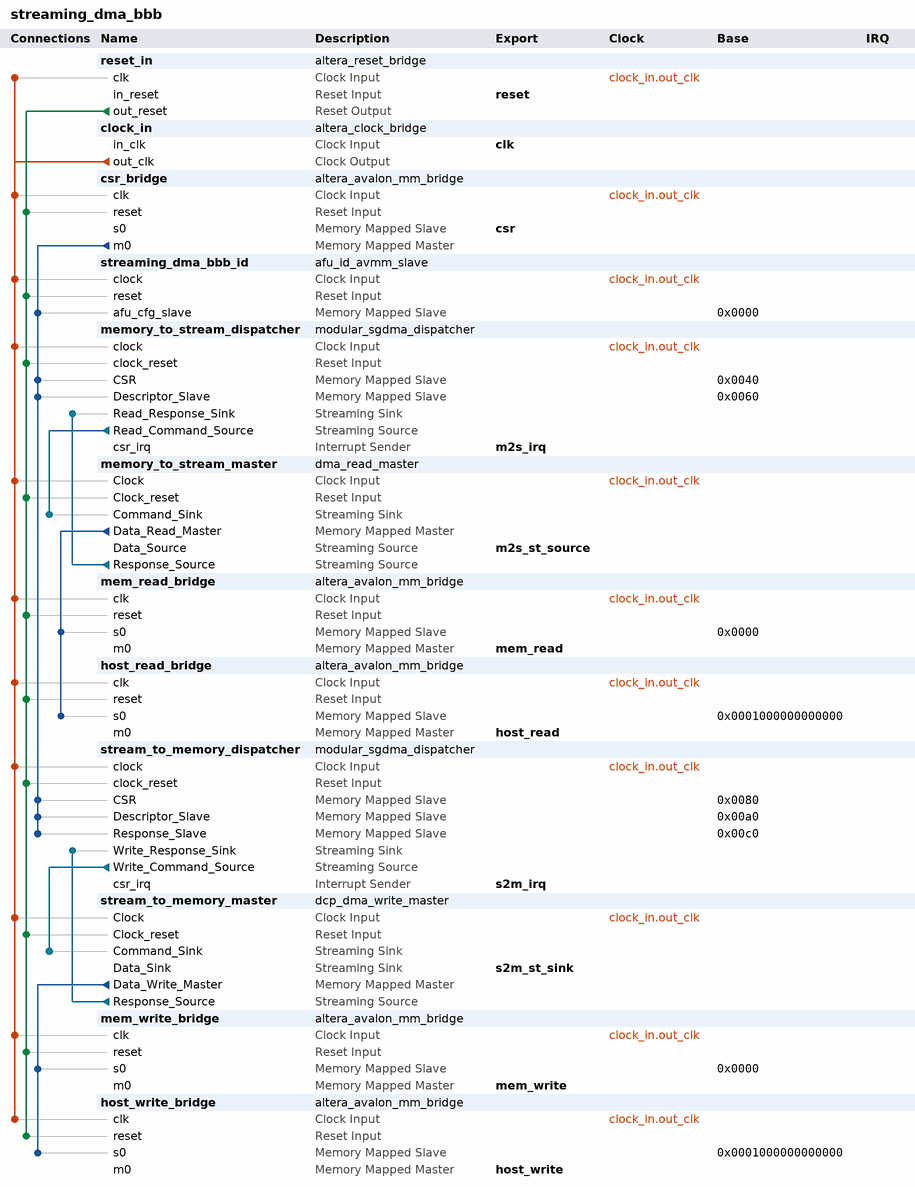
[diagram p0: system contents]
# Platform Designer (Qsys) system streaming_dma_bbb, Arria 10 10AX115N3F40E2SG
# Parameters at their usual value, and those the tool derives, are not listed.
package require -exact qsys 1.0
create_system streaming_dma_bbb
set_project_property DEVICE_FAMILY {Arria 10}
set_project_property DEVICE 10AX115N3F40E2SG

add_component reset_in ip/streaming_dma_bbb/streaming_dma_bbb_reset_in.ip altera_reset_bridge reset_in 17.0

add_component clock_in ip/streaming_dma_bbb/streaming_dma_bbb_clock_in.ip altera_clock_bridge clock_in 17.0

add_component csr_bridge ip/streaming_dma_bbb/csr_bridge.ip altera_avalon_mm_bridge csr_bridge 17.0

add_component streaming_dma_bbb_id ip/streaming_dma_bbb/streaming_dma_bbb_id.ip afu_id_avmm_slave streaming_dma_bbb_id 1.0

add_component memory_to_stream_dispatcher ip/streaming_dma_bbb/memory_to_stream_dispatcher.ip modular_sgdma_dispatcher memory_to_stream_dispatcher 17.0

add_component memory_to_stream_master ip/streaming_dma_bbb/memory_to_stream_master.ip dma_read_master memory_to_stream_master 17.0

add_component mem_read_bridge ip/streaming_dma_bbb/mem_read_bridge.ip altera_avalon_mm_bridge mem_read_bridge 17.0

add_component host_read_bridge ip/streaming_dma_bbb/host_read_bridge.ip altera_avalon_mm_bridge host_read_bridge 17.0

add_component stream_to_memory_dispatcher ip/streaming_dma_bbb/stream_to_memory_dispatcher.ip modular_sgdma_dispatcher stream_to_memory_dispatcher 17.0

add_component stream_to_memory_master ip/streaming_dma_bbb/stream_to_memory_master.ip dcp_dma_write_master stream_to_memory_master 17.0

add_component mem_write_bridge ip/streaming_dma_bbb/mem_write_bridge.ip altera_avalon_mm_bridge mem_write_bridge 17.0

add_component host_write_bridge ip/streaming_dma_bbb/host_write_bridge.ip altera_avalon_mm_bridge host_write_bridge 17.0

# connections
add_connection clock_in.out_clk csr_bridge.clk clock
add_connection clock_in.out_clk host_read_bridge.clk clock
add_connection clock_in.out_clk host_write_bridge.clk clock
add_connection clock_in.out_clk mem_read_bridge.clk clock
add_connection clock_in.out_clk mem_write_bridge.clk clock
add_connection clock_in.out_clk memory_to_stream_dispatcher.clock clock
add_connection clock_in.out_clk memory_to_stream_master.Clock clock
add_connection clock_in.out_clk reset_in.clk clock
add_connection clock_in.out_clk stream_to_memory_dispatcher.clock clock
add_connection clock_in.out_clk stream_to_memory_master.Clock clock
add_connection clock_in.out_clk streaming_dma_bbb_id.clock clock
add_connection reset_in.out_reset csr_bridge.reset reset
add_connection reset_in.out_reset host_read_bridge.reset reset
add_connection reset_in.out_reset host_write_bridge.reset reset
add_connection reset_in.out_reset mem_read_bridge.reset reset
add_connection reset_in.out_reset mem_write_bridge.reset reset
add_connection reset_in.out_reset memory_to_stream_dispatcher.clock_reset reset
add_connection reset_in.out_reset memory_to_stream_master.Clock_reset reset
add_connection reset_in.out_reset stream_to_memory_dispatcher.clock_reset reset
add_connection reset_in.out_reset stream_to_memory_master.Clock_reset reset
add_connection reset_in.out_reset streaming_dma_bbb_id.reset reset
add_connection csr_bridge.m0 memory_to_stream_dispatcher.CSR avalon
set_connection_parameter_value csr_bridge.m0/memory_to_stream_dispatcher.CSR baseAddress 0x0040
add_connection csr_bridge.m0 memory_to_stream_dispatcher.Descriptor_Slave avalon
set_connection_parameter_value csr_bridge.m0/memory_to_stream_dispatcher.Descriptor_Slave baseAddress 0x0060
add_connection csr_bridge.m0 stream_to_memory_dispatcher.CSR avalon
set_connection_parameter_value csr_bridge.m0/stream_to_memory_dispatcher.CSR baseAddress 0x0080
add_connection csr_bridge.m0 stream_to_memory_dispatcher.Descriptor_Slave avalon
set_connection_parameter_value csr_bridge.m0/stream_to_memory_dispatcher.Descriptor_Slave baseAddress 0x00a0
add_connection csr_bridge.m0 stream_to_memory_dispatcher.Response_Slave avalon
set_connection_parameter_value csr_bridge.m0/stream_to_memory_dispatcher.Response_Slave baseAddress 0x00c0
add_connection csr_bridge.m0 streaming_dma_bbb_id.afu_cfg_slave avalon
set_connection_parameter_value csr_bridge.m0/streaming_dma_bbb_id.afu_cfg_slave baseAddress 0x0000
add_connection memory_to_stream_master.Data_Read_Master host_read_bridge.s0 avalon
set_connection_parameter_value memory_to_stream_master.Data_Read_Master/host_read_bridge.s0 baseAddress 0x0001000000000000
add_connection memory_to_stream_master.Data_Read_Master mem_read_bridge.s0 avalon
set_connection_parameter_value memory_to_stream_master.Data_Read_Master/mem_read_bridge.s0 baseAddress 0x0000
add_connection stream_to_memory_master.Data_Write_Master host_write_bridge.s0 avalon
set_connection_parameter_value stream_to_memory_master.Data_Write_Master/host_write_bridge.s0 baseAddress 0x0001000000000000
add_connection stream_to_memory_master.Data_Write_Master mem_write_bridge.s0 avalon
set_connection_parameter_value stream_to_memory_master.Data_Write_Master/mem_write_bridge.s0 baseAddress 0x0000
add_connection memory_to_stream_dispatcher.Read_Command_Source memory_to_stream_master.Command_Sink avalon_streaming
add_connection memory_to_stream_master.Response_Source memory_to_stream_dispatcher.Read_Response_Sink avalon_streaming
add_connection stream_to_memory_dispatcher.Write_Command_Source stream_to_memory_master.Command_Sink avalon_streaming
add_connection stream_to_memory_master.Response_Source stream_to_memory_dispatcher.Write_Response_Sink avalon_streaming

# exported interfaces
add_interface clk clock sink
set_interface_property clk EXPORT_OF clock_in.in_clk
add_interface csr avalon slave
set_interface_property csr EXPORT_OF csr_bridge.s0
add_interface host_read avalon master
set_interface_property host_read EXPORT_OF host_read_bridge.m0
add_interface host_write avalon master
set_interface_property host_write EXPORT_OF host_write_bridge.m0
add_interface m2s_irq interrupt sender
set_interface_property m2s_irq EXPORT_OF memory_to_stream_dispatcher.csr_irq
add_interface m2s_st_source avalon_streaming source
set_interface_property m2s_st_source EXPORT_OF memory_to_stream_master.Data_Source
add_interface mem_read avalon master
set_interface_property mem_read EXPORT_OF mem_read_bridge.m0
add_interface mem_write avalon master
set_interface_property mem_write EXPORT_OF mem_write_bridge.m0
add_interface reset reset sink
set_interface_property reset EXPORT_OF reset_in.in_reset
add_interface s2m_irq interrupt sender
set_interface_property s2m_irq EXPORT_OF stream_to_memory_dispatcher.csr_irq
add_interface s2m_st_sink avalon_streaming sink
set_interface_property s2m_st_sink EXPORT_OF stream_to_memory_master.Data_Sink

set_interconnect_requirement {$system} qsys_mm.clockCrossingAdapter HANDSHAKE
set_interconnect_requirement {$system} qsys_mm.enableEccProtection FALSE
set_interconnect_requirement {$system} qsys_mm.insertDefaultSlave FALSE
set_interconnect_requirement {$system} qsys_mm.maxAdditionalLatency 1

save_system streaming_dma_bbb.qsys
